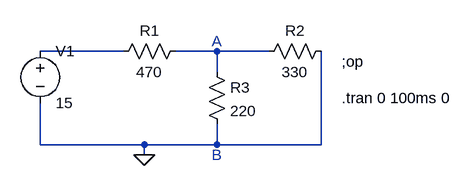
[diagram p0: schematic KCL - KVL.asc]
KCL - KVL.asc, the LTspice schematic file:
Version 4
SHEET 1 880 680
WIRE 176 128 48 128
WIRE 320 128 256 128
WIRE 400 128 320 128
WIRE 320 160 320 128
WIRE 48 272 48 208
WIRE 208 272 48 272
WIRE 320 272 320 240
WIRE 320 272 208 272
WIRE 480 272 480 128
WIRE 480 272 320 272
WIRE 208 288 208 272
FLAG 208 288 0
SYMBOL voltage 48 112 R0
SYMATTR InstName V1
SYMATTR Value 15
SYMBOL res 272 112 R90
WINDOW 0 0 56 VBottom 2
WINDOW 3 32 56 VTop 2
SYMATTR InstName R1
SYMATTR Value 470
SYMBOL res 496 112 R90
WINDOW 0 0 56 VBottom 2
WINDOW 3 32 56 VTop 2
SYMATTR InstName R2
SYMATTR Value 330
SYMBOL res 304 144 R0
SYMATTR InstName R3
SYMATTR Value 220
TEXT 312 112 Left 2 ;A
TEXT 312 288 Left 2 ;B
TEXT 512 144 Left 2 !;op
TEXT 512 200 Left 2 !.tran 0 100ms 0

The netlist it stands for:
* KCL - KVL.asc
V1 N001 0 15
R1 N002 N001 470
R2 0 N002 330
R3 N002 0 220
* A
* B
;op
.tran 0 100ms 0
.backanno
.end